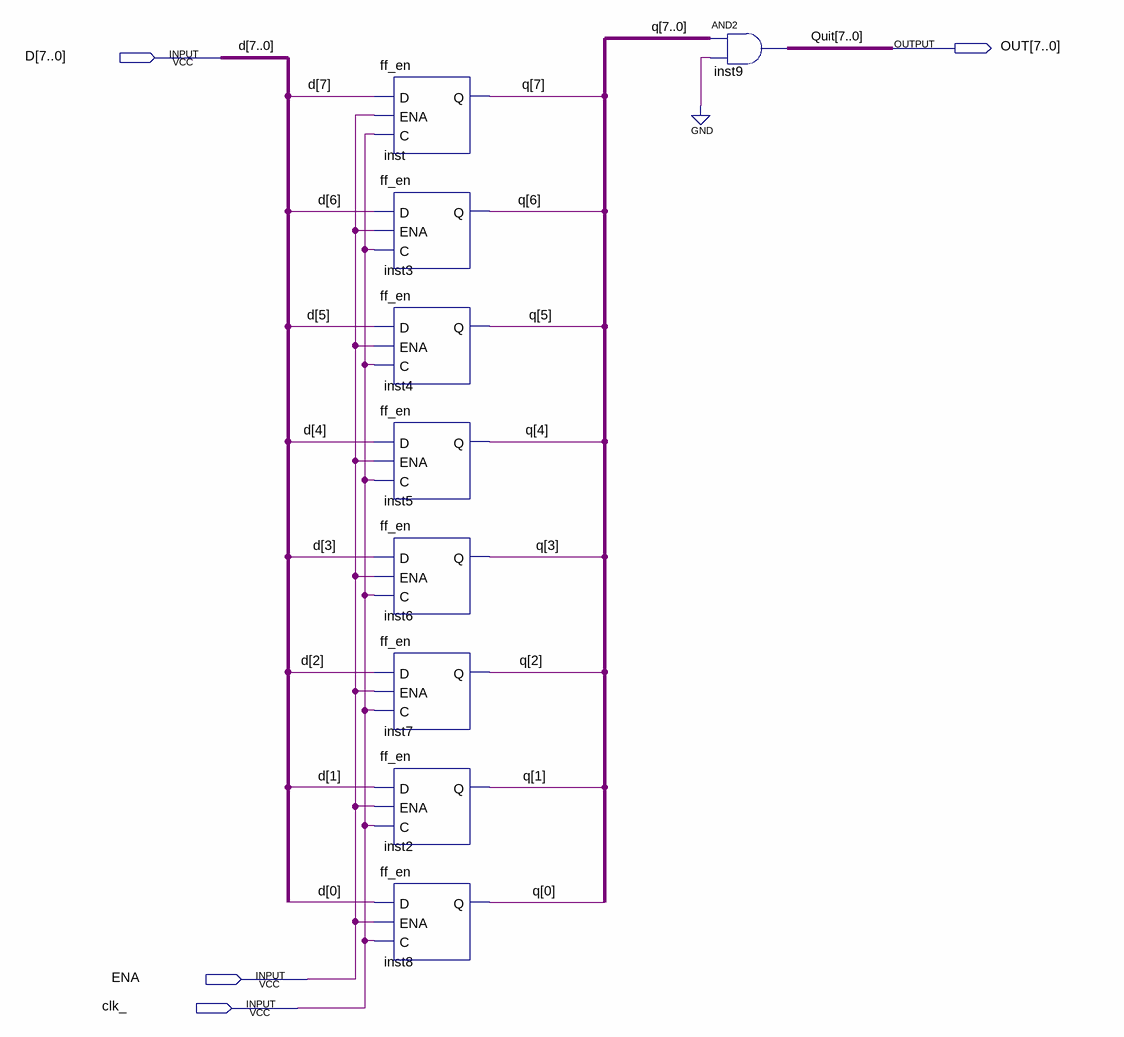
[diagram p0: schematic sheet]
// Quartus schematic ff8_0.bdf as structural Verilog: 9 symbols, 4 pins
module ff8_0 (
  input  [7:0] D,
  input  ENA,
  input  clk_,
  output [7:0] OUT
);

  wire [7:0] q;

  ff_en inst (.D(D[7]), .ENA(ENA), .C(clk_), .Q(q[7]));
  ff_en inst3 (.D(D[6]), .ENA(ENA), .C(clk_), .Q(q[6]));
  ff_en inst4 (.D(D[5]), .ENA(ENA), .C(clk_), .Q(q[5]));
  ff_en inst5 (.D(D[4]), .ENA(ENA), .C(clk_), .Q(q[4]));
  ff_en inst6 (.D(D[3]), .ENA(ENA), .C(clk_), .Q(q[3]));
  ff_en inst7 (.D(D[2]), .ENA(ENA), .C(clk_), .Q(q[2]));
  ff_en inst2 (.D(D[1]), .ENA(ENA), .C(clk_), .Q(q[1]));
  ff_en inst8 (.D(D[0]), .ENA(ENA), .C(clk_), .Q(q[0]));
  assign OUT = q & {8{1'b0}};  // AND2 inst9, 8 bits wide

  // Other names for the same wires on the sheet: Quit[7:0] = OUT
endmodule
